# Altium schematic sheet main.SchDoc
size A; SheetNumber: 1; SheetTotal: 4
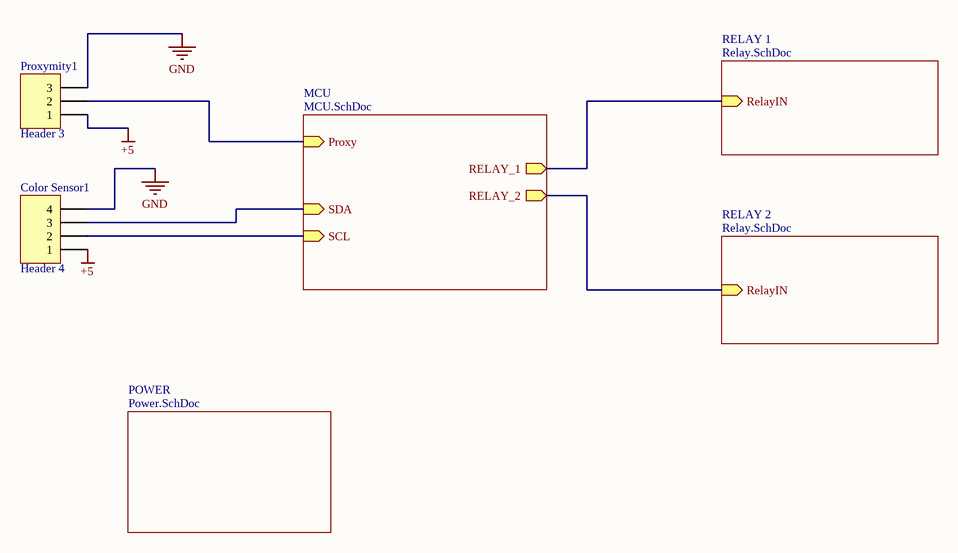
[diagram p0: main.SchDoc]

## Parts
Color_Sensor1  Header 4  [HDR1X4]
Proxymity1  Header 3  [HDR1X3]

## Sub-sheets
MCU = MCU.SchDoc: RELAY_2 (out), RELAY_1 (out), SDA (in), Proxy (in), SCL (in)
POWER = Power.SchDoc: no entries
RELAY 1 = Relay.SchDoc: RelayIN (in)
RELAY 2 = Relay.SchDoc: RelayIN (in)

## Nets
+5: Color_Sensor1.1 Proxymity1.1
GND: Color_Sensor1.4 Proxymity1.3
NetColor_Sensor1_2: Color_Sensor1.2 ; sheet MCU/SCL
NetColor_Sensor1_3: Color_Sensor1.3 ; sheet MCU/SDA
NetProxymity1_2: Proxymity1.2 ; sheet MCU/Proxy
(unnamed): sheet MCU/RELAY_2, sheet RELAY 2/RelayIN
(unnamed): sheet MCU/RELAY_1, sheet RELAY 1/RelayIN

## Library data of the parts
Color_Sensor1 = Header 4: Header, 4-Pin; LatestRevisionDate: 17-Jul-2002; LatestRevisionNote: Re-released for DXP Platform.; Publisher: Altium Limited
Proxymity1 = Header 3: Header, 3-Pin; LatestRevisionDate: 17-Jul-2002; LatestRevisionNote: Re-released for DXP Platform.; Publisher: Altium Limited